# Altium project lf-esp.PrjPcb
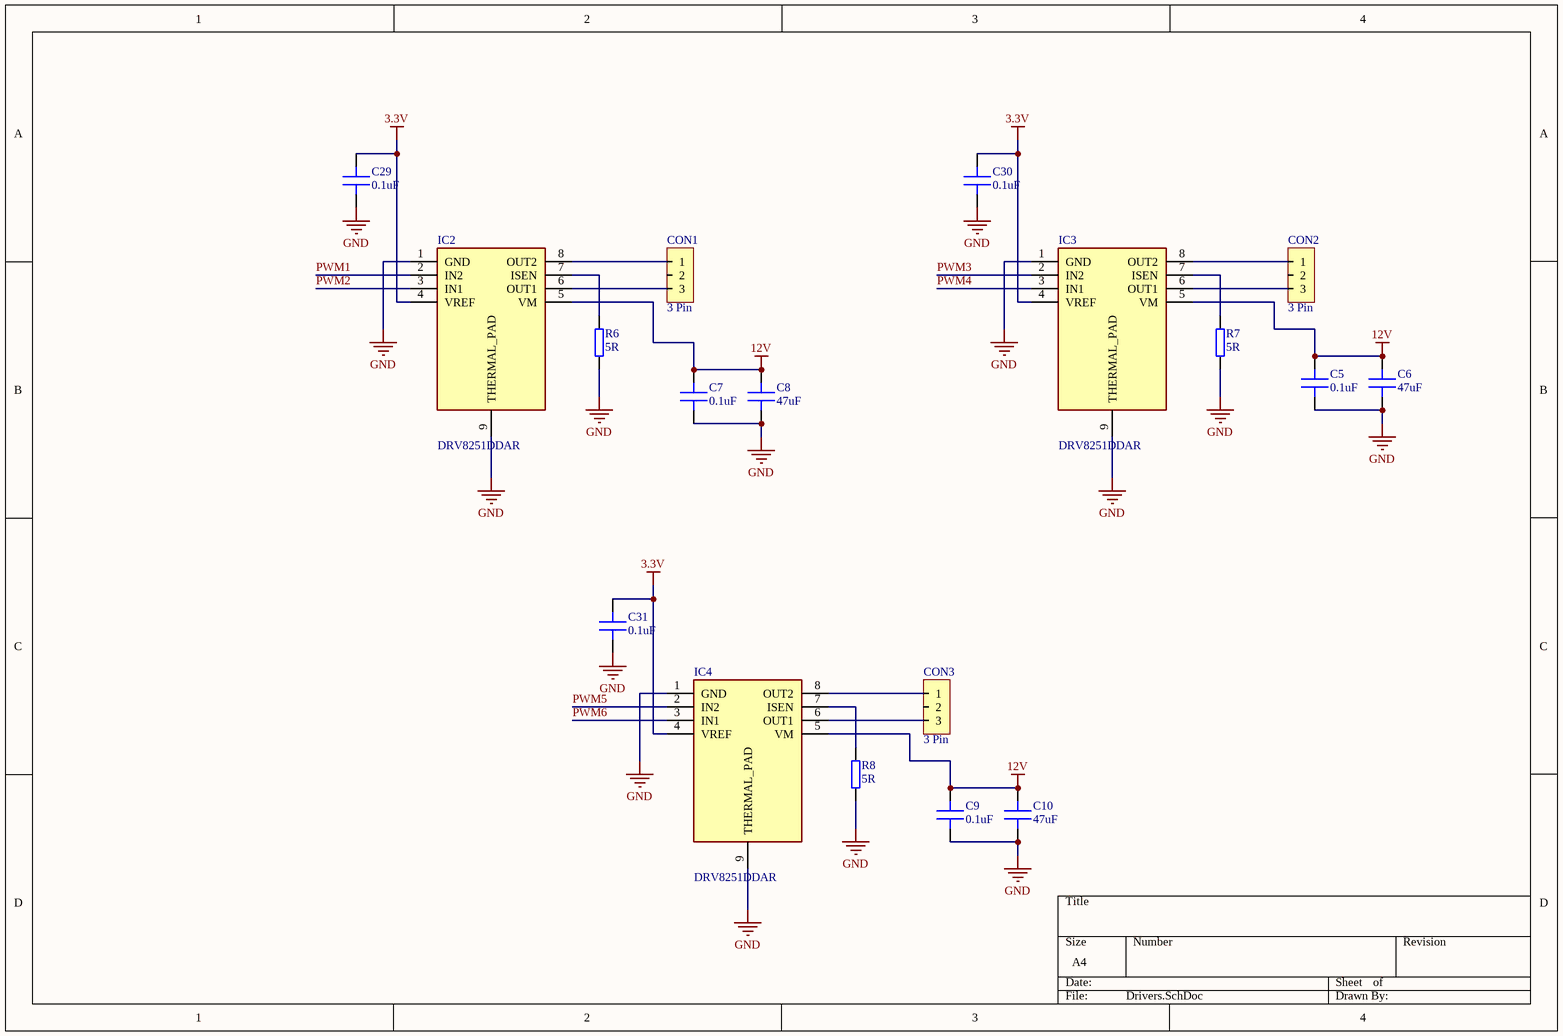
[diagram p0: Drivers.SchDoc]
3 sheets, 70 parts. Net scope: global (net labels, ports and power ports of the same name join across sheets).
Board file: LF-ESP-V1.PcbDoc
Sheets:
  Drivers.SchDoc
  Power-line.SchDoc
  MCU_LF.SchDoc

## Sheet Drivers.SchDoc
size A4; SheetNumber: 1; SheetTotal: 3

### Parts
C5  0.1uF  [C 0402]
C6  47uF  [C 1206]
C7  0.1uF  [C 0402]
C8  47uF  [C 1206]
C9  0.1uF  [C 0402]
C10  47uF  [C 1206]
C29  0.1uF  [C 0402]
C30  0.1uF  [C 0402]
C31  0.1uF  [C 0402]
CON1  3 Pin  [BM03B-SRSS-TB]
CON2  3 Pin  [BM03B-SRSS-TB]
CON3  3 Pin  [BM03B-SRSS-TB]
IC2  DRV8251DDAR  [SOIC127P600X170-9N]
IC3  DRV8251DDAR  [SOIC127P600X170-9N]
IC4  DRV8251DDAR  [SOIC127P600X170-9N]
R6  5R  [R 1206]
R7  5R  [R 1206]
R8  5R  [R 1206]

### Nets
3.3V: C29.1 C30.1 C31.1 IC2.4(VREF) IC3.4(VREF) IC4.4(VREF)
12V: C5.1 C6.1 C7.1 C8.1 C9.1 C10.1 IC2.5(VM) IC3.5(VM) IC4.5(VM)
GND: C5.2 C6.2 C7.2 C8.2 C9.2 C10.2 C29.2 C30.2 C31.2 IC2.1(GND) IC2.9(THERMAL_PAD) IC3.1(GND) IC3.9(THERMAL_PAD) IC4.1(GND) IC4.9(THERMAL_PAD) R6.1 R7.1 R8.1
PWM1: IC2.2(IN2)
PWM2: IC2.3(IN1)
PWM3: IC3.2(IN2)
PWM4: IC3.3(IN1)
PWM5: IC4.2(IN2)
PWM6: IC4.3(IN1)
NetCON1_1: CON1.1 IC2.8(OUT2)
NetCON1_3: CON1.3 IC2.6(OUT1)
NetCON2_1: CON2.1 IC3.8(OUT2)
NetCON2_3: CON2.3 IC3.6(OUT1)
NetCON3_1: CON3.1 IC4.8(OUT2)
NetCON3_3: CON3.3 IC4.6(OUT1)
NetIC2_7: IC2.7(ISEN) R6.2
NetIC3_7: IC3.7(ISEN) R7.2
NetIC4_7: IC4.7(ISEN) R8.2

Not connected (* = marked no-connect by the designer): CON1 2; CON2 2; CON3 2

### Library data of the parts
C5-C10 C29-C31 = Capacitor: MLCC Capacitor
IC2-IC4 = DRV8251DDAR: Integrated Circuit; Manufacturer_Name: Texas Instruments; Datasheet Link: https://www.arrow.com/en/products/drv8251ddar/texas-instruments?region=nac; Height: 1.7mm; Manufacturer_Part_Number: DRV8251DDAR; Mouser Part Number: 595-DRV8251DDAR; Mouser Price/Stock: https://www.mouser.co.uk/ProductDetail/Texas-Instruments/DRV8251DDAR?qs=doiCPypUmgHTzZyfapGahQ%3D%3D; Arrow Part Number: DRV8251DDAR; Arrow Price/Stock: https://www.arrow.com/en/products/drv8251ddar/texas-instruments?region=nac
R6-R8 = Resistor: General pourpouse resistor

## Sheet Power-line.SchDoc
size A4; SheetNumber: 3; SheetTotal: 3
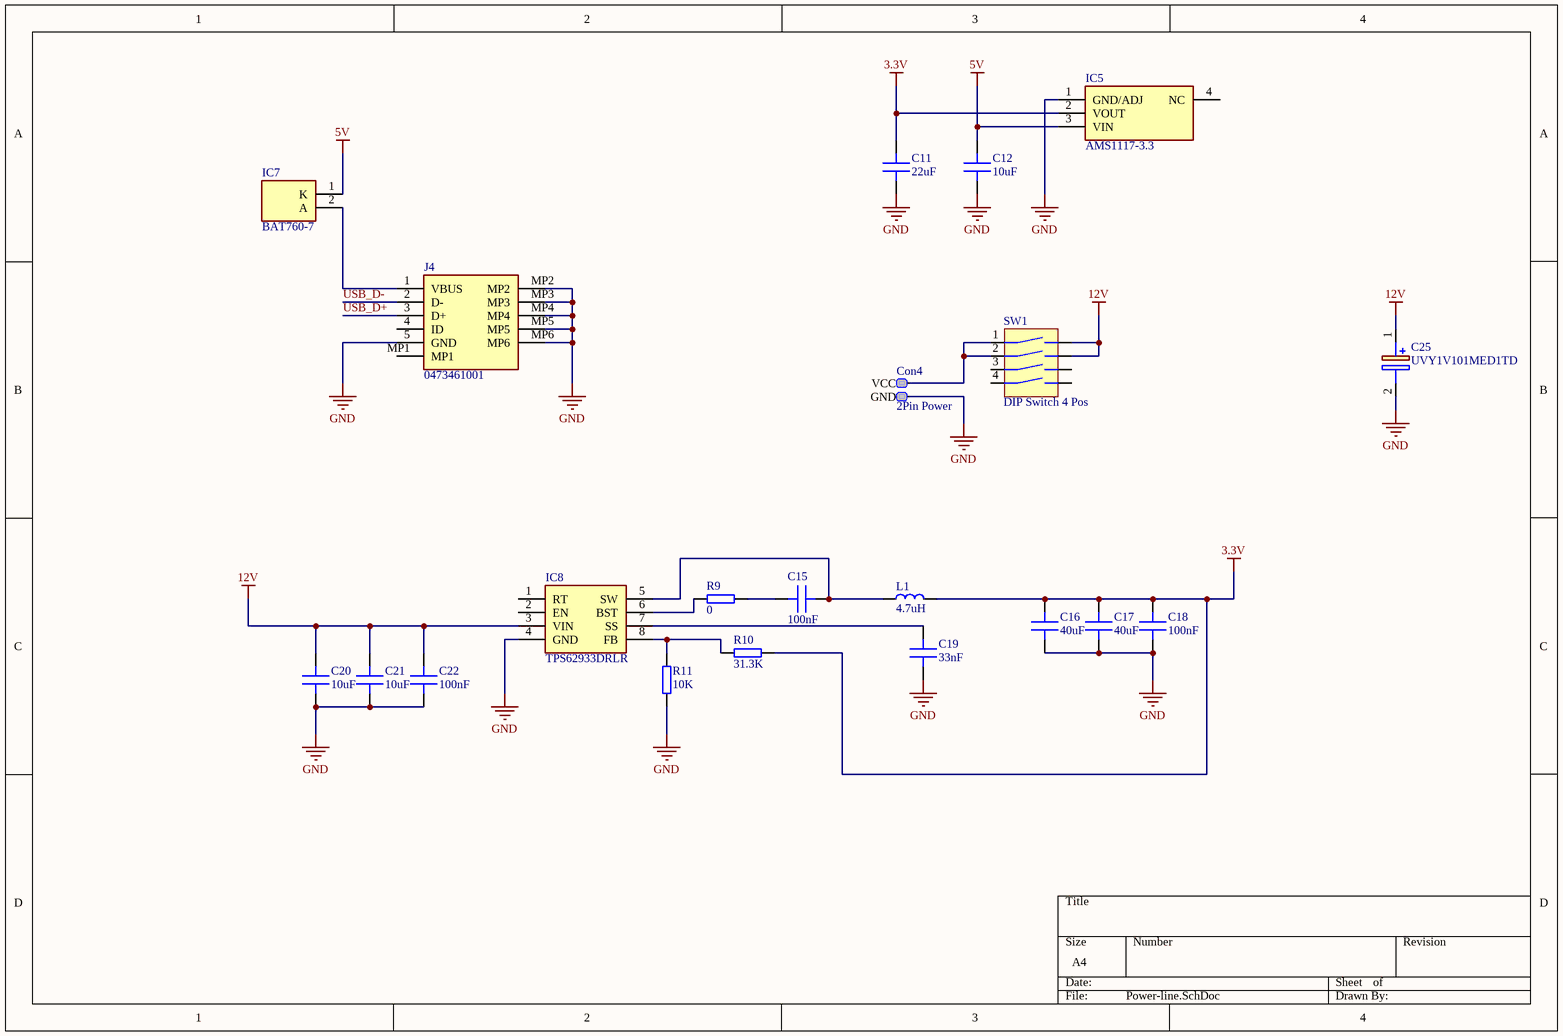
[diagram p1: Power-line.SchDoc]

### Parts
C11  22uF  [C 0805]
C12  10uF  [C 0805]
C15  100nF  [C 0402]
C16  40uF  [C 1206]
C17  40uF  [C 1206]
C18  100nF  [C 0603]
C19  33nF  [C 0402]
C20  10uF  [C 1206]
C21  10uF  [C 1206]
C22  100nF  [C 0603]
C25  UVY1V101MED1TD  [CAPPRD250W50D655H1250]
Con4  2Pin Power  [B2B-ZR-SM4A-TF]
IC5  AMS1117-3.3  [SOT229P700X180-4N]
IC7  BAT760-7  [SOD2513X120N]
IC8  TPS62933DRLR  [SOTFL50P160X60-8N]
J4  0473461001  [0473461001]
L1  4.7uH  [HPI0630]
R9  0  [R 0402]
R10  31.3K  [R 0402]
R11  10K  [R 0402]
SW1  DIP Switch 4 Pos  [DIP Switch 4 pos 2.54mm]

### Nets
3.3V: C11.1 C16.1 C17.1 C18.1 IC5.2(VOUT) L1.2 R10.1
5V: C12.1 IC5.3(VIN) IC7.1(K)
12V: C20.1 C21.1 C22.1 C25.1(+) IC8.3(VIN) SW1.7 SW1.8
GND: C11.2 C12.2 C16.2 C17.2 C18.2 C19.2 C20.2 C21.2 C22.2 C25.2(-) Con4.2(GND) IC5.1(GND/ADJ) IC8.4(GND) J4.5(GND) J4.MP2 J4.MP3 J4.MP4 J4.MP5 J4.MP6 R11.1
USB_D+: J4.3(D+)
USB_D-: J4.2(D-)
NetC15_1: C15.1 R9.1
NetC15_2: C15.2 IC8.5(SW) L1.1
NetC19_1: C19.1 IC8.7(SS)
NetCon4_1: Con4.1(VCC) SW1.1 SW1.2
NetIC7_2: IC7.2(A) J4.1(VBUS)
NetIC8_6: IC8.6(BST) R9.2
NetIC8_8: IC8.8(FB) R10.2 R11.2

Not connected (* = marked no-connect by the designer): IC5 4(NC); IC8 1(RT) 2(EN); J4 4(ID) MP1; SW1 3 4 5 6

### Library data of the parts
C11 C12 C15-C22 = Capacitor: MLCC Capacitor
C25 = UVY1V101MED1TD: Capacitor Polarised; Manufacturer_Name: Nichicon; Datasheet Link: http://nichicon-us.com/english/products/pdfs/e-uvy.pdf; Height: 12.5mm; Manufacturer_Part_Number: UVY1V101MED1TD; Arrow Part Number: UVY1V101MED1TD; Arrow Price/Stock: https://www.arrow.com/en/products/uvy1v101med1td/nichicon
IC5 = AMS1117-3.3: Integrated Circuit; Manufacturer_Name: Advanced; Datasheet Link: https://datasheet.datasheetarchive.com/originals/distributors/Datasheets-28/DSA-550594.pdf; Height: 1.8mm; Manufacturer_Part_Number: AMS1117-3.3
IC7 = BAT760-7: Integrated Circuit; Manufacturer_Name: Lattice Semiconductor; Datasheet Link: https://www.diodes.com/assets/Datasheets/ds30498.pdf; Height: 1.2mm; Manufacturer_Part_Number: BAT760-7; Mouser Part Number: N/A; Mouser Price/Stock: https://www.mouser.com/Search/Refine.aspx?Keyword=N%2FA
IC8 = TPS62933DRLR: Integrated Circuit; Manufacturer_Name: Texas Instruments; Datasheet Link: https://www.ti.com/lit/ds/symlink/tps62933.pdf?ts=1626073394234; Height: 0.6mm; Manufacturer_Part_Number: TPS62933DRLR; Mouser Part Number: 595-TPS62933DRLR; Mouser Price/Stock: https://www.mouser.co.uk/ProductDetail/Texas-Instruments/TPS62933DRLR?qs=Rp5uXu7WBW9fv47wfQVntQ%3D%3D; Arrow Part Number: TPS62933DRLR; Arrow Price/Stock: https://www.arrow.com/en/products/tps62933drlr/texas-instruments?utm_currency=USD&region=nac
J4 = 0473461001: Connector; Manufacturer_Name: Molex; Datasheet Link: https://componentsearchengine.com/Datasheets/1/0473461001.pdf; Height: 2.45mm; Manufacturer_Part_Number: 0473461001; Mouser Part Number: N/A; Mouser Price/Stock: https://www.mouser.co.uk/ProductDetail/Molex/0473461001?qs=2bnkQPT%252BPafTZgGVt%2FOGfA%3D%3D; Arrow Part Number: 0473461001; Arrow Price/Stock: https://www.arrow.com/en/products/0473461001/molex?region=nac
L1 = Inductor: General pourpouse inductor
R9-R11 = Resistor: General pourpouse resistor

## Sheet MCU_LF.SchDoc
size A4; SheetNumber: 3; SheetTotal: 3
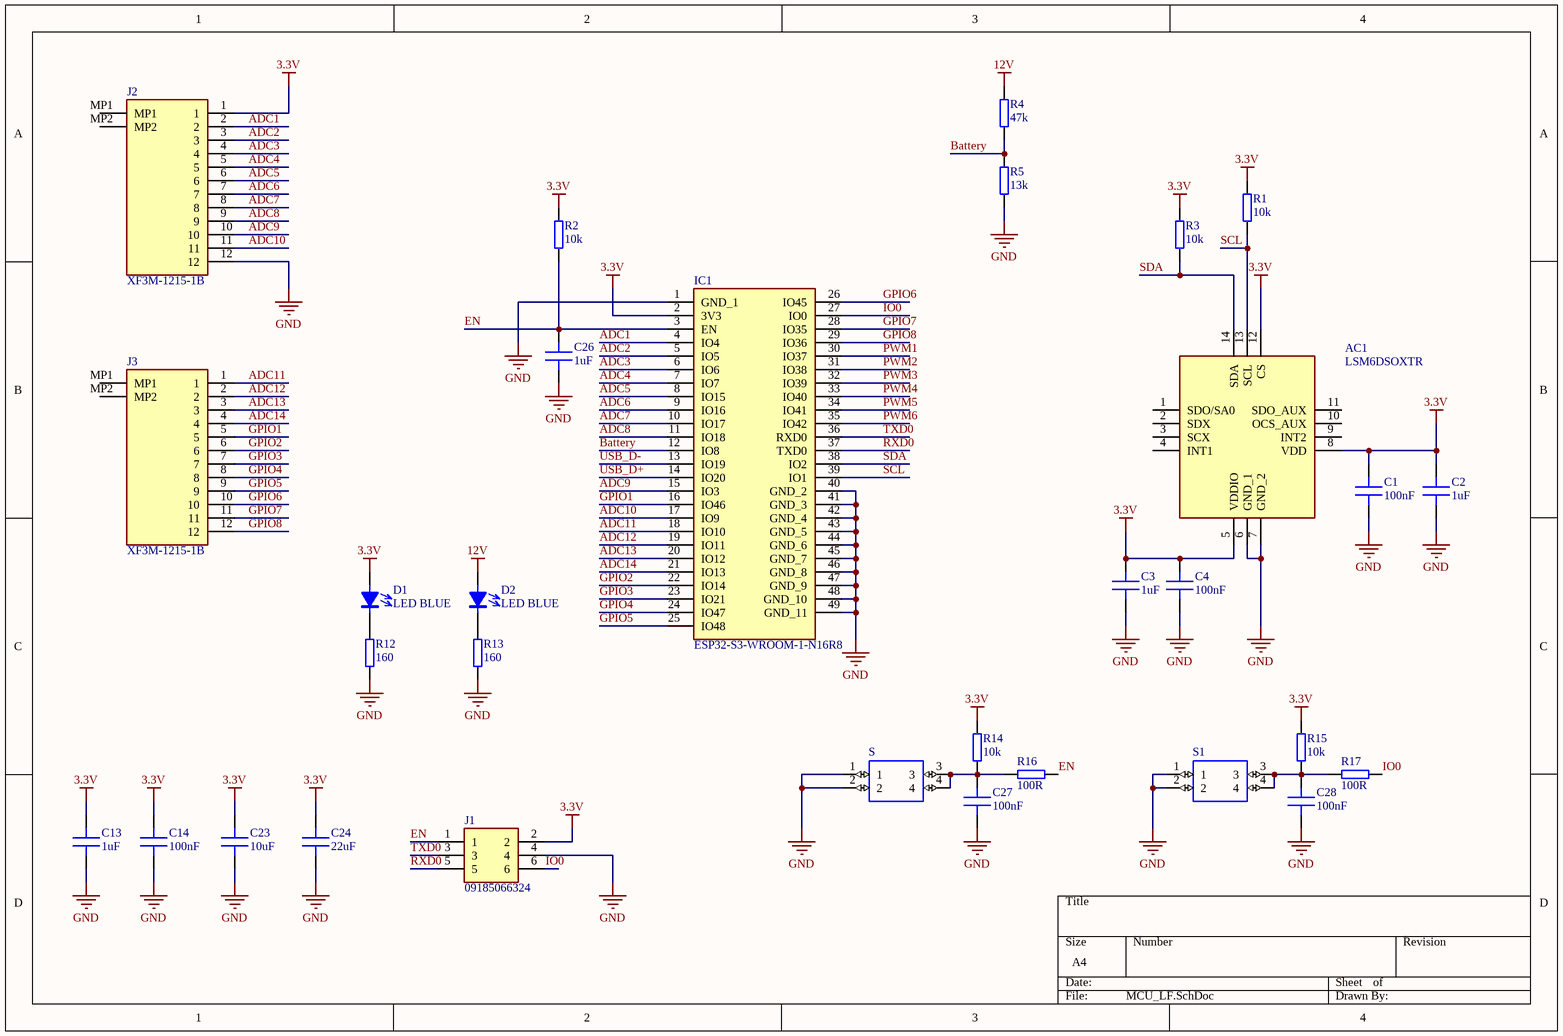
[diagram p2: MCU_LF.SchDoc]

### Parts
AC1  LSM6DSOXTR  [LGA-14_1]
C1  100nF  [C 0402]
C2  1uF  [C 0402]
C3  1uF  [C 0402]
C4  100nF  [C 0402]
C13  1uF  [C 0402]
C14  100nF  [C 0402]
C23  10uF  [C 0402]
C24  22uF  [C 0402]
C26  1uF  [C 0402]
C27  100nF  [C 0402]
C28  100nF  [C 0402]
D1  LED BLUE  [LED 0603 BLUE]
D2  LED BLUE  [LED 0603 BLUE]
IC1  ESP32-S3-WROOM-1-N16R8  [ESP32S3WROOM1N16R8]
J1  09185066324  [09185066324]
J2  XF3M-1215-1B  [XF3M12151B]
J3  XF3M-1215-1B  [XF3M12151B]
R1  10k  [R 0402]
R2  10k  [R 0402]
R3  10k  [R 0402]
R4  47k  [R 0402]
R5  13k  [R 0402]
R12  160  [R 0402]
R13  160  [R 0402]
R14  10k  [R 0402]
R15  10k  [R 0402]
R16  100R  [R 0402]
R17  100R  [R 0402]
S  PTS810SJK250SMTRLFS  [PTS810SJG250SMTRLFS]  (value not drawn)
S1  PTS810SJK250SMTRLFS  [PTS810SJG250SMTRLFS]  (value not drawn)

### Nets
3.3V: AC1.5(VDDIO) AC1.8(VDD) AC1.12(CS) C1.1 C2.1 C3.1 C4.1 C13.1 C14.1 C23.1 C24.1 D1.1 IC1.2(3V3) J1.2 J2.1 R1.2 R2.2 R3.2 R14.2 R15.2
12V: D2.1 R4.2
GND: AC1.6(GND_1) AC1.7(GND_2) C1.2 C2.2 C3.2 C4.2 C13.2 C14.2 C23.2 C24.2 C26.2 C27.2 C28.2 IC1.1(GND_1) IC1.40(GND_2) IC1.41(GND_3) IC1.42(GND_4) IC1.43(GND_5) IC1.44(GND_6) IC1.45(GND_7) IC1.46(GND_8) IC1.47(GND_9) IC1.48(GND_10) IC1.49(GND_11) J1.4 J2.12 R5.1 R12.1 R13.1 S.1 S.2 S1.1 S1.2
ADC1: IC1.4(IO4) J2.2
ADC2: IC1.5(IO5) J2.3
ADC3: IC1.6(IO6) J2.4
ADC4: IC1.7(IO7) J2.5
ADC5: IC1.8(IO15) J2.6
ADC6: IC1.9(IO16) J2.7
ADC7: IC1.10(IO17) J2.8
ADC8: IC1.11(IO18) J2.9
ADC9: IC1.15(IO3) J2.10
ADC10: IC1.17(IO9) J2.11
ADC11: IC1.18(IO10) J3.1
ADC12: IC1.19(IO11) J3.2
ADC13: IC1.20(IO12) J3.3
ADC14: IC1.21(IO13) J3.4
Battery: IC1.12(IO8) R4.1 R5.2
EN: C26.1 IC1.3(EN) J1.1 R2.1 R16.1
GPIO1: IC1.16(IO46) J3.5
GPIO2: IC1.22(IO14) J3.6
GPIO3: IC1.23(IO21) J3.7
GPIO4: IC1.24(IO47) J3.8
GPIO5: IC1.25(IO48) J3.9
GPIO6: IC1.26(IO45) J3.10
GPIO7: IC1.28(IO35) J3.11
GPIO8: IC1.29(IO36) J3.12
IO0: IC1.27(IO0) J1.6 R17.1
PWM1: IC1.30(IO37)
PWM2: IC1.31(IO38)
PWM3: IC1.32(IO39)
PWM4: IC1.33(IO40)
PWM5: IC1.34(IO41)
PWM6: IC1.35(IO42)
RXD0: IC1.37(TXD0) J1.5
SCL: AC1.13(SCL) IC1.39(IO1) R1.1
SDA: AC1.14(SDA) IC1.38(IO2) R3.1
TXD0: IC1.36(RXD0) J1.3
USB_D+: IC1.14(IO20)
USB_D-: IC1.13(IO19)
NetC27_1: C27.1 R14.1 R16.2 S.3 S.4
NetC28_1: C28.1 R15.1 R17.2 S1.3 S1.4
NetD1_2: D1.2 R12.2
NetD2_2: D2.2 R13.2

Not connected (* = marked no-connect by the designer): AC1 1(SDO/SA0) 2(SDX) 3(SCX) 4(INT1) 9(INT2) 10(OCS_AUX) 11(SDO_AUX); J2 MP1 MP2; J3 MP1 MP2

### Library data of the parts
AC1 = LSM6DSOXTR: Accelerometer; Manufacturer_Name: STMicroelectronics; Datasheet Link: https://www.st.com/resource/en/datasheet/lsm6dsox.pdf; Manufacturer_Part_Number: LSM6DSOXTR; Mouser Part Number: 511-LSM6DSOXTR; Mouser Price/Stock: https://www.mouser.co.uk/ProductDetail/STMicroelectronics/LSM6DSOXTR?qs=l7cgNqFNU1i9dcjzItLpVQ%3D%3D; Arrow Part Number: LSM6DSOXTR; Arrow Price/Stock: https://www.arrow.com/en/products/lsm6dsoxtr/stmicroelectronics?region=europe
C1-C4 C13 C14 C23 C24 C26-C28 = Capacitor: MLCC Capacitor
IC1 = ESP32-S3-WROOM-1-N16R8: Integrated Circuit; Manufacturer_Name: Espressif Systems; Datasheet Link: https://www.espressif.com/sites/default/files/documentation/esp32-s3-wroom-1_wroom-1u_datasheet_en.pdf; Height: 3.25mm; Manufacturer_Part_Number: ESP32-S3-WROOM-1-N16R8; Mouser Part Number: 356-ESP32S3WRM1N16R8; Mouser Price/Stock: https://www.mouser.co.uk/ProductDetail/Espressif-Systems/ESP32-S3-WROOM-1-N16R8?qs=Li%252BoUPsLEnvQc9gW6AMhZg%3D%3D
J1 = 09185066324: Connector; Manufacturer_Name: HARTING; Datasheet Link: https://b2b.harting.com/files/download/PRD/PDF_DS/PDF_DS_09185066324_EN.pdf; Manufacturer_Part_Number: 09185066324; Mouser Part Number: 617-09185066324; Mouser Price/Stock: https://www.mouser.co.uk/ProductDetail/HARTING/09185066324?qs=qa49y27LPCE%2F3ZplMsKEeQ%3D%3D; Arrow Part Number: 09185066324; Arrow Price/Stock: https://www.arrow.com/en/products/09185066324/harting?utm_currency=USD&region=europe
J2 J3 = XF3M-1215-1B: Connector; Manufacturer_Name: Omron Electronics; Datasheet Link: https://datasheet.lcsc.com/szlcsc/Omron-Electronics-XF3M-1215-1B_C231431.pdf; Height: 2mm; Manufacturer_Part_Number: XF3M-1215-1B; Mouser Part Number: 653-XF3M-1215-1B; Mouser Price/Stock: https://www.mouser.co.uk/ProductDetail/Omron-Electronics/XF3M-1215-1B?qs=1He0yLMpldAQYeSJcjbchQ%3D%3D; Arrow Part Number: XF3M-1215-1B; Arrow Price/Stock: https://www.arrow.com/en/products/xf3m-1215-1b/omron
R1-R5 R12-R17 = Resistor: General pourpouse resistor
S S1 = PTS810SJK250SMTRLFS: Tactile Switch SPST-NO Top Actuated Surface Mount; MF: C&K; SnapEDA_Link: https://www.snapeda.com/parts/PTS810SJK250SMTRLFS/C%26K/view-part/274682/?ref=snap; Package: None; Price: None; MP: PTS810SJK250SMTRLFS; Availability: Unavailable; Value: *

## Nets that join several sheets
3.3V: Drivers (6 pins), Power-line (7 pins), MCU_LF (20 pins)
12V: Drivers (9 pins), Power-line (7 pins), MCU_LF (D2.1 R4.2)
GND: Drivers (18 pins), Power-line (20 pins), MCU_LF (33 pins)
PWM1: Drivers (IC2.2), MCU_LF (IC1.30)
PWM2: Drivers (IC2.3), MCU_LF (IC1.31)
PWM3: Drivers (IC3.2), MCU_LF (IC1.32)
PWM4: Drivers (IC3.3), MCU_LF (IC1.33)
PWM5: Drivers (IC4.2), MCU_LF (IC1.34)
PWM6: Drivers (IC4.3), MCU_LF (IC1.35)
USB_D+: Power-line (J4.3), MCU_LF (IC1.14)
USB_D-: Power-line (J4.2), MCU_LF (IC1.13)